# Altium project Arduino portenta H7 carrier board.PrjPcb
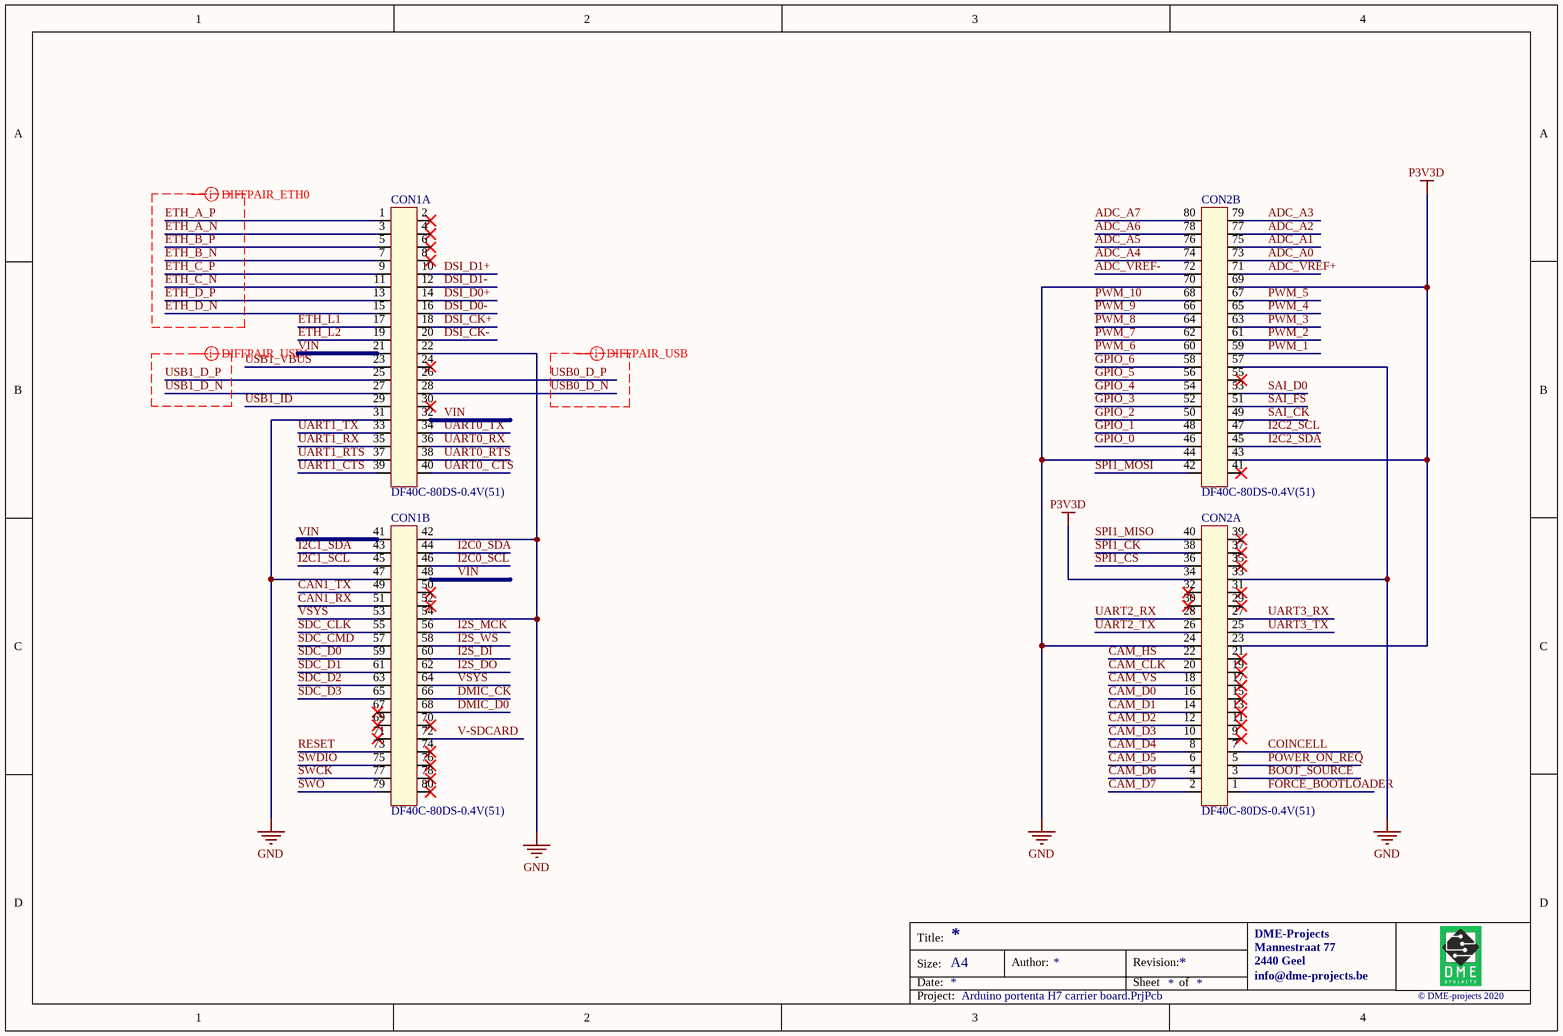
[diagram p0: Potenta connections.SchDoc]
CAGE_CODE: ?????; CONTRACT_NUMBER: <CONTRACT NO>; DOC_NO_ASSY_DWG: <ASSY DWG NO>; DOC_NO_BOM: <BOM DOC NO>; DOC_NO_FAB_DWG: <FAB DWG NO>; DOC_NO_SCH_DWG: <SCH DWG NO>; PCB_2_DEC_TOL: +/-.01; PCB_3_DEC_TOL: +/-.010; PCB_ANG_TOL: +/-1/2; PCB_ASSEMBLY_NO: <PCB ASSY NO>; PCB_CHECKER: - -----; PCB_CHECKER_APP_DATE: --/--/----; PCB_DESIGNER: - -----; PCB_DESIGNER_APP_DATE: --/--/----; PCB_DWG_NO: <PCB DWG NO>; PCB_ENGINEER: - -----; PCB_ENGINEER_APP_DATE: --/--/----; PCB_PART_NUMBER: <PCB PN>; PCB_REV: A; SCH_REV: A
4 sheets, 45 parts. Net scope: global (net labels, ports and power ports of the same name join across sheets).
Board file: Portenta H7 Carrier board.PcbDoc
Sheets:
  Potenta connections.SchDoc
  PC CONNECTIONS.SchDoc
  Expantion connectors.SchDoc
  Arduino connectors.SchDoc

## Sheet Potenta connections.SchDoc
size A4; Organization: Mirion Technologies (Canberra Olen) NV; Address1: Lammerdries-Oost 25; Address2: 2250; Address3: Olen; Address4: Belgium; ENG_APP_DATE: --/--/--; DSN_APP_DATE: --/--/--; CHK_APP_DATE: --/--/--

### Parts
CON1  DF40C-80DS-0.4V(51)  [DF40C-80DS-0.4V(51)-Footprint-1]  (parts A,B of 2)
CON2  DF40C-80DS-0.4V(51)  [DF40C-80DS-0.4V(51)-Footprint-1]  (parts A,B of 2)

### Nets
GND: CON1.22 CON1.31 CON1.42 CON1.47 CON1.54 CON2.24 CON2.33 CON2.44 CON2.57 CON2.70
P3V3D: CON2.23 CON2.34 CON2.43 CON2.69
ADC_A0: CON2.73
ADC_A1: CON2.75
ADC_A2: CON2.77
ADC_A3: CON2.79
ADC_A4: CON2.74
ADC_A5: CON2.76
ADC_A6: CON2.78
ADC_A7: CON2.80
ADC_VREF+: CON2.71
ADC_VREF-: CON2.72
BOOT_SOURCE: CON2.3
CAM_CLK: CON2.20
CAM_D0: CON2.16
CAM_D1: CON2.14
CAM_D2: CON2.12
CAM_D3: CON2.10
CAM_D4: CON2.8
CAM_D5: CON2.6
CAM_D6: CON2.4
CAM_D7: CON2.2
CAM_HS: CON2.22
CAM_VS: CON2.18
CAN1_RX: CON1.51
CAN1_TX: CON1.49
COINCELL: CON2.7
DMIC_CK: CON1.66
DMIC_D0: CON1.68
DSI_CK+: CON1.18
DSI_CK-: CON1.20
DSI_D0+: CON1.14
DSI_D0-: CON1.16
DSI_D1+: CON1.10
DSI_D1-: CON1.12
ETH_A_N: CON1.3
ETH_A_P: CON1.1
ETH_B_N: CON1.7
ETH_B_P: CON1.5
ETH_C_N: CON1.11
ETH_C_P: CON1.9
ETH_D_N: CON1.15
ETH_D_P: CON1.13
ETH_L1: CON1.17
ETH_L2: CON1.19
FORCE_BOOTLOADER: CON2.1
GPIO_0: CON2.46
GPIO_1: CON2.48
GPIO_2: CON2.50
GPIO_3: CON2.52
GPIO_4: CON2.54
GPIO_5: CON2.56
GPIO_6: CON2.58
I2C0_SCL: CON1.46
I2C0_SDA: CON1.44
I2C1_SCL: CON1.45
I2C1_SDA: CON1.43
I2C2_SCL: CON2.47
I2C2_SDA: CON2.45
I2S_DI: CON1.60
I2S_DO: CON1.62
I2S_MCK: CON1.56
I2S_WS: CON1.58
POWER_ON_REQ: CON2.5
PWM_1: CON2.59
PWM_2: CON2.61
PWM_3: CON2.63
PWM_4: CON2.65
PWM_5: CON2.67
PWM_6: CON2.60
PWM_7: CON2.62
PWM_8: CON2.64
PWM_9: CON2.66
PWM_10: CON2.68
RESET: CON1.73
SAI_CK: CON2.49
SAI_D0: CON2.53
SAI_FS: CON2.51
SDC_CLK: CON1.55
SDC_CMD: CON1.57
SDC_D0: CON1.59
SDC_D1: CON1.61
SDC_D2: CON1.63
SDC_D3: CON1.65
SPI1_CK: CON2.38
SPI1_CS: CON2.36
SPI1_MISO: CON2.40
SPI1_MOSI: CON2.42
SWCK: CON1.77
SWDIO: CON1.75
SWO: CON1.79
UART0_ CTS: CON1.40
UART0_RTS: CON1.38
UART0_RX: CON1.36
UART0_TX: CON1.34
UART1_CTS: CON1.39
UART1_RTS: CON1.37
UART1_RX: CON1.35
UART1_TX: CON1.33
UART2_RX: CON2.28
UART2_TX: CON2.26
UART3_RX: CON2.27
UART3_TX: CON2.25
USB0_D_N: CON1.28
USB0_D_P: CON1.26
USB1_D_N: CON1.27
USB1_D_P: CON1.25
USB1_ID: CON1.29
USB1_VBUS: CON1.23
V-SDCARD: CON1.72
VIN: CON1.21 CON1.32 CON1.41 CON1.48
VSYS: CON1.53 CON1.64

Not connected (* = marked no-connect by the designer): CON1 2* 4* 6* 8* 24* 30* 50* 52* 67* 69* 70* 71* 74* 76* 78* 80*; CON2 9* 11* 13* 15* 17* 19* 21* 29* 30* 31* 32* 35* 37* 39* 41* 55*

### Layout directives
differential pair; differential pair class DIFFPAIR_ETH0: ETH_A_N, ETH_A_P, ETH_B_N, ETH_B_P, ETH_C_N, ETH_C_P, ETH_D_N, ETH_D_P
differential pair; differential pair class DIFFPAIR_USB: USB0_D_N, USB0_D_P, USB1_D_N, USB1_D_P

### Notes on the sheet
- Title:
- Size:
- Date:
- A4
- Author:
- Revision:
- Sheet
- of
- DME-Projects
- Mannestraat 77
- 2440 Geel
- info@dme-projects.be
- Project:
- © DME-projects 2020

### Library data of the parts
CON1 CON2 = CMP-00029-4: DF40 Series 80 Positions 0.4 mm Pitch Dual Row SMT Receptacle Connector; Number of Contacts: 80; Mated Stacking Heights: 1.5mm; Pitch: 0.4mm; Current Rating: 300mA; Voltage Rating: 30V; Number of Rows: 2; Package Quantity: 1; Contact Material: Bronze; Housing Material: Polymer; Mount: Surface Mount; Connector Type: Receptacle; REACH SVHC: Unknown; Contact Plating: Gold; Lead Free: Lead Free; Radiation Hardening: No; Packaging: Tape and Reel; Gender: Receptacle; Termination: SMD/SMT; Number of Positions: 80; PartId: 1

## Sheet PC CONNECTIONS.SchDoc
size A4
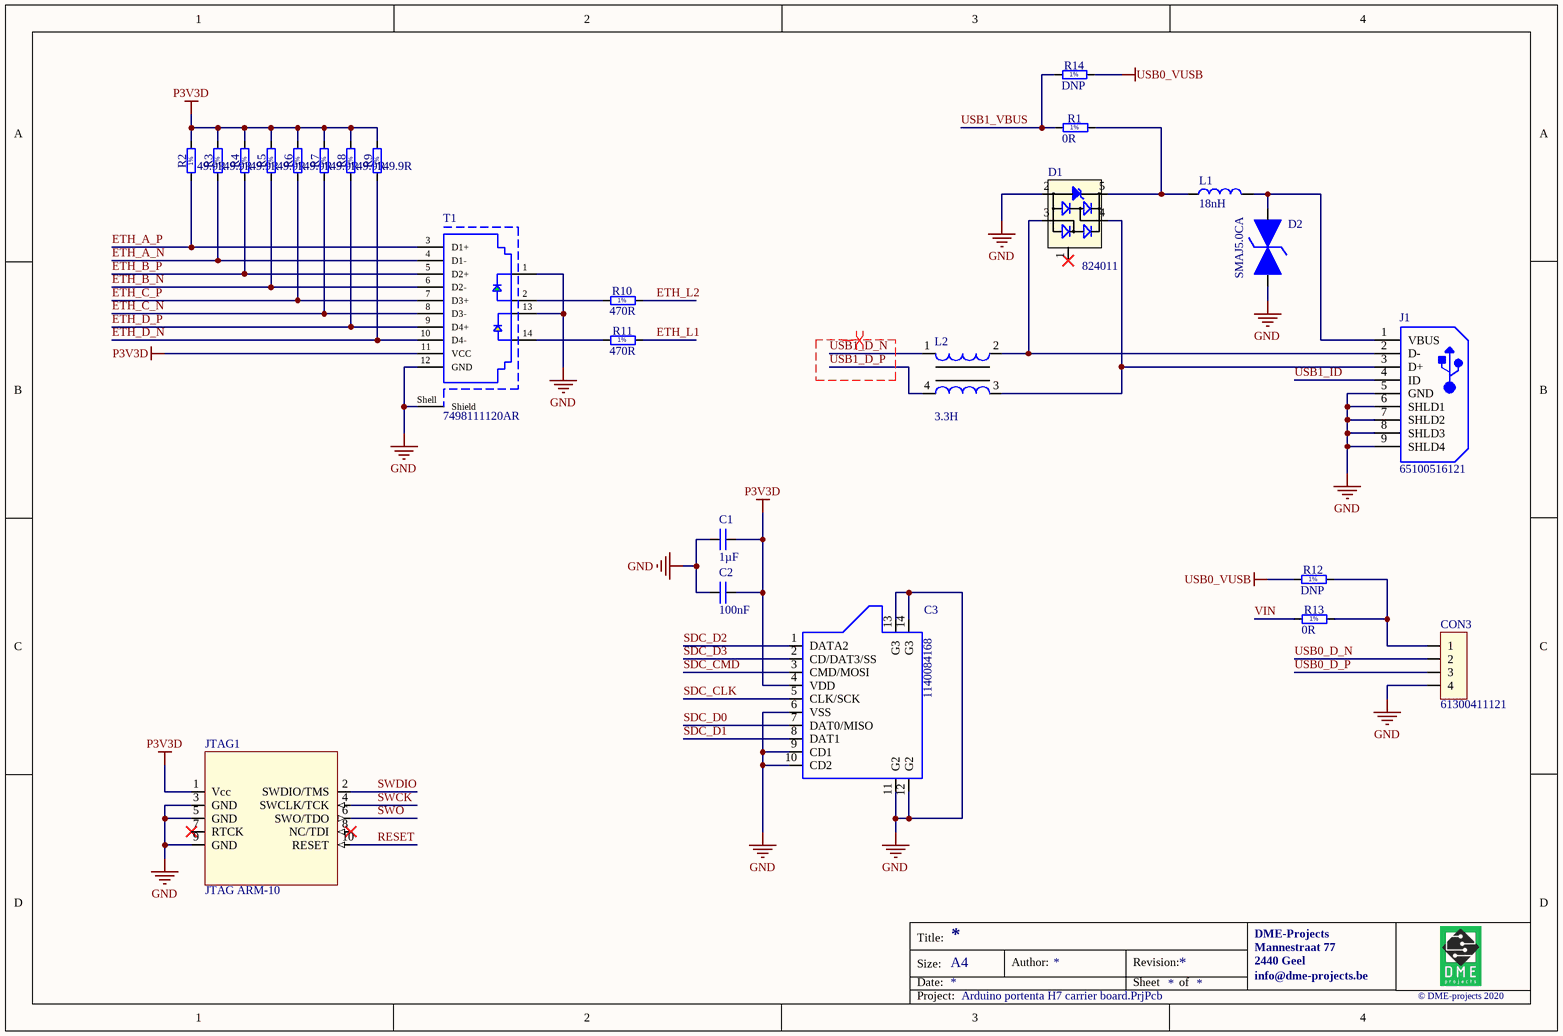
[diagram p1: PC CONNECTIONS.SchDoc]

### Parts
C1  value 1µF  [C0603]  (hidden comment: 447)
C2  value 100nF  [C0603]  (hidden comment: 423)
C3  1140084168  [Amphenol_MicroSD_Connector]
CON3  61300411121  [61300411121]
D1  824011  [ATML-5TS1_N]
D2  SMAJ5.0CA  [FP-SMAJ-MFG]
J1  65100516121  [WE-65100516121_V]
JTAG1  JTAG ARM-10  [62501021621]
L1  Inductance: 18nH  [SMD-0603]  (hidden comment: 742792641)
L2  Inductance: 3.3H  [WE-CNSW-1206]  (hidden comment: 744232090)
R1  value 0R  [R0603]  (hidden comment: 1040)
R2  value 49.9R  [R0603]  (hidden comment: 1020)
R3  value 49.9R  [R0603]  (hidden comment: 1020)
R4  value 49.9R  [R0603]  (hidden comment: 1020)
R5  value 49.9R  [R0603]  (hidden comment: 1020)
R6  value 49.9R  [R0603]  (hidden comment: 1020)
R7  value 49.9R  [R0603]  (hidden comment: 1020)
R8  value 49.9R  [R0603]  (hidden comment: 1020)
R9  value 49.9R  [R0603]  (hidden comment: 1020)
R10  value 470R  [R0603]  (hidden comment: 427)
R11  value 470R  [R0603]  (hidden comment: 427)
R12  value DNP  [R0603]  (hidden comment: 1041)
R13  value 0R  [R0603]  (hidden comment: 1040)
R14  value DNP  [R0603]  (hidden comment: 1041)
T1  7498111120AR  [7498111120AR]

### Nets
GND: C1.2 C2.1 C3.6(VSS) C3.9(CD1) C3.10(CD2) C3.11(G2) C3.12(G2) C3.13(G3) C3.14(G3) CON3.4 D1.2(GND) D2.1 J1.5(GND) J1.6(SHLD1) J1.7(SHLD2) J1.8(SHLD3) J1.9(SHLD4) JTAG1.3(GND) JTAG1.5(GND) JTAG1.9(GND) T1.1 T1.12(GND) T1.13 T1.Shell(Shield)
P3V3D: C1.1 C2.2 C3.4(VDD) JTAG1.1(Vcc) R2.2 R3.2 R4.2 R5.2 R6.2 R7.2 R8.2 R9.2 T1.11(VCC)
USB0_VUSB: R12.1 R14.2
ETH_A_N: R3.1 T1.4(D1-)
ETH_A_P: R2.1 T1.3(D1+)
ETH_B_N: R5.1 T1.6(D2-)
ETH_B_P: R4.1 T1.5(D2+)
ETH_C_N: R7.1 T1.8(D3-)
ETH_C_P: R6.1 T1.7(D3+)
ETH_D_N: R9.1 T1.10(D4-)
ETH_D_P: R8.1 T1.9(D4+)
ETH_L1: R11.2
ETH_L2: R10.2
RESET: JTAG1.10(RESET)
SDC_CLK: C3.5(CLK/SCK)
SDC_CMD: C3.3(CMD/MOSI)
SDC_D0: C3.7(DAT0/MISO)
SDC_D1: C3.8(DAT1)
SDC_D2: C3.1(DATA2)
SDC_D3: C3.2(CD/DAT3/SS)
SWCK: JTAG1.4(SWCLK/TCK)
SWDIO: JTAG1.2(SWDIO/TMS)
SWO: JTAG1.6(SWO/TDO)
USB0_D_N: CON3.2
USB0_D_P: CON3.3
USB1_D_N: L2.1
USB1_D_P: L2.4
USB1_ID: J1.4(ID)
USB1_VBUS: R1.1 R14.1
VIN: R13.1
NetCON3_1: CON3.1 R12.2 R13.2
NetD1_3: D1.3(I/O1) J1.2(D-) L2.2
NetD1_4: D1.4(I/O2) J1.3(D+) L2.3
NetD1_5: D1.5(VDD) L1.1 R1.2
NetD2_2: D2.2 J1.1(VBUS) L1.2
NetR10_1: R10.1 T1.2
NetR11_1: R11.1 T1.14

Not connected (* = marked no-connect by the designer): D1 1(NC)*; JTAG1 7(RTCK)* 8(NC/TDI)*

### Layout directives
differential pair: USB1_D_N, USB1_D_P

### Notes on the sheet
- Title:
- Size:
- Date:
- A4
- Author:
- Revision:
- Sheet
- of
- DME-Projects
- Mannestraat 77
- 2440 Geel
- info@dme-projects.be
- Project:
- © DME-projects 2020
- (in symbol CMP-209-0426-1) 1%
- (in symbol CMP-209-1019-1) 1%
- (in symbol CMP-209-1037-1) 1%
- (in symbol CMP-209-1038-1) 1%

### Library data of the parts
C1 = CMP-208-0446-2: generic 0603 capacitor; Type: Ceramic; Tolerance: 0.05; Voltage: 25V; MFG no: generic; MFG: generic
C2 = CMP-208-0422-4: generic 0603 capacitor; Tolerance: 0.05; Voltage: 50V; Type: Ceramic; MFG no: generic; MFG: generic
C3 = CMP-00036-2: Micro SD; Conn; IC Socket; ; Right Angle; PCB Mount; MicroSD Ser.; Gender: Receptacle; Pitch: 1.1mm; Number of Contacts: 8; Connector Type: Connector; Housing Material: Polymer; Package Quantity: 7500; Length: 15.6mm; Lead Free: Lead Free; Packaging: Tape and Reel; Termination: SMD/SMT; Mount: Surface Mount; Depth: 11.45mm; Contact Material: Copper Alloy,Copper; Radiation Hardening: No; Number of Rows: 1; Height: 1.55mm; Orientation: Right Angle; Contact Plating: Gold; Flammability Rating: UL94 V-0; REACH SVHC: Unknown
CON3 = CMP-00034-1: CONN HEADER VERT 4POS 2.54MM; Gender: Male; Number of Contacts: 4; Connector Type: Male Pin; Pitch: 0.1inch; Lead Free: Lead Free; Contact Material: Copper; Contact Mating Length: 0.236inch; Number of Rows: 1; REACH SVHC: Unknown; Number of Positions: 4; Packaging: Bulk; Mount: Through Hole; Contact Plating: Gold; Termination: Solder; Color: Black
D1 = CMP-004-00034-3: Trans Voltage Suppressor Diode, 5V V(RWM), Unidirectional, 1 Element, Silicon; Clamping Voltage: 8.5V; Test Current: 1mA; Max Surge Current: 12A; Power Line Protection: Yes; Max Reverse Leakage Current: 5A; Polarity: Bidirectional; Capacitance: 2pF; Number of Channels: 2; Min Breakdown Voltage: 6.1V; Operating Supply Voltage: 6V; Reverse Standoff Voltage: 5V; Packaging: Tape and Reel; Max Operating Temperature: 125°C; Working Voltage: 5V; Number of Pins: 5; Termination: SMD/SMT; Peak Pulse Current: 12A; Height: 1.16mm; Direction: Unidirectional; Mount: Surface Mount; Number of Bidirectional Channels: 2; ESD Protection: Yes; Breakdown Voltage: 6.1V; Max Breakdown Voltage: 6.1V; Length: 2.9mm; Case/Package: SOT-23; Package Quantity: 3000; REACH SVHC: Unknown; Min Operating Temperature: -55°C; Width: 2.8mm
D2 = CMP-00032-1: BOURNS - SMAJ5.0CA - TVS Diode, TRANSZORB SMAJ Series, Bidirectional, 5 V, 9.2 V, DO-214AC (SMA), 2 Pins; ESD Protection: Yes; Reverse Breakdown Voltage: 6.4V; Max Breakdown Voltage: 7V; Reverse Standoff Voltage: 5V; Number of Elements: 1; Diode Type: ZENER; Test Current: 10mA; Leakage Current: 1.6mA; Max Surge Current: 40A; Element Configuration: Single; Peak Pulse Power: 400W; Peak Pulse Current: 43.5A; Power Line Protection: No; Clamping Voltage: 9.2V; Case/Package: DO-214AC; Termination: SMD/SMT; Radiation Hardening: No; Polarity: Bidirectional; Direction: Bidirectional; Number of Channels: 1; Packaging: Tape and Reel; Min Operating Temperature: -55°C; Max Operating Temperature: 150°C; Max Reverse Leakage Current: 1.6mA; Breakdown Voltage: 7V; REACH SVHC: No SVHC; Series: SMAJ; Contact Plating: Tin; Number of Bidirectional Channels: 1; Resistor Type: Zener; Operating Supply Voltage: 5V; Package Quantity: 1; Max Power Dissipation: 400W; Number of Pins: 2; Min Breakdown Voltage: 6.4V; Mount: Surface Mount
J1 = CMP-00031-1: CONN RCPT USB2.0 MINI B SMD R/A; Number of Ports: 1; Contact Resistance: 20mR; Number of Contacts: 5; Gender: Receptacle; Working Voltage: 30V; Connector Type: USB; Mating Cycles: 1500; Insulation Resistance: 1GR; Current Rating: 1A; USB Standard: USB 2.0; Length: 7.7mm; Contact Plating: Gold; Termination: Solder; Mount: Surface Mount,Horizontal; Max Operating Temperature: 105°C; Orientation: Right Angle; Color: Black; Contact Material: Copper Alloy; REACH SVHC: Unknown; Min Operating Temperature: -40°C; Number of Positions: 5; Packaging: Tape and Reel; Package Quantity: 500; Voltage Rating: 30V; Flammability Rating: UL94 V-0; Width: 9.25mm; Series: WR-COM; Lead Free: Lead Free
JTAG1 = CMP-002-00269-2: JTAG ARM 10 pin interface connector 2mm pitch
L1 = CMP-00033-1: FERRITE BEAD 300 OHM 0603 1LN; DC Resistance (DCR): 150mR; Impedance: 300R; Max Current Rating: 2A; Number of Lines: 1; Tolerance: 25%; Test Frequency: 100MHz; Case/Package: SMD/SMT; Min Operating Temperature: -55°C; Series: WE-CBF; Depth: 0.8mm; Height: 0.8mm; Core Material: Ferrite; Width: 0.8mm; Packaging: Tape and Reel; Length: 1.6mm; Case Code (Metric): 1608; Lead Free: Lead Free; Case Code (Imperial): 0603; Max DC Current: 2A; REACH SVHC: Unknown; Max Operating Temperature: 125°C; Package Quantity: 1; Current Rating: 2A; Mount: Surface Mount; Weight: 0.000141oz; Termination: SMD/SMT; Material: Ferrite
L2 = CMP-006-00021-2: Data Line Filter, 2 Function(s), 50V, 0.37A; Test Frequency: 100MHz; Resistance: 300mR; Max DC Current: 370mA; Tolerance: 25%; Number of Lines: 2; Impedance: 90R; Core Material: Ferrite; Length: 3.2mm; Weight: 0.001376oz; DC Resistance (DCR): 300mR; Current Rating: 370mA; Mount: Surface Mount; Frequency: 100MHz; Height: 0.083inch; Min Operating Temperature: -40°C; Max Current Rating: 370mA; Max Operating Temperature: 125°C; Current: 370mA; Voltage Rating (DC): 50V; REACH SVHC: No SVHC; Termination: SMD/SMT; Depth: 1.6mm; Voltage Rating: 50V; Width: 1.6mm; Packaging: Tape and Reel; Lead Free: Lead Free; Case/Package: 1206; Package Quantity: 1
R1 R13 = CMP-209-1037-1: generic 0603 Thick film resistor; Power: 100mW; Tolerance: 0.01; Voltage: 75V; Type: Thick film; MFG: generic; MFG no: generic
R2-R9 = CMP-209-1019-1: generic 0603 Thick film resistor; Voltage: 75V; Tolerance: 0.01; Power: 100mW; MFG: generic; Type: Thick film; MFG no: generic
R10 R11 = CMP-209-0426-1: generic 0603 Thick film resistor; Power: 100mW; Tolerance: 0.01; Voltage: 75V; Type: Thick film; MFG no: generic; MFG: generic
R12 R14 = CMP-209-1038-1: generic 0603 Thick film resistor; Voltage: 75V; Power: 100mW; MFG no: generic; Type: Thick film; MFG: generic
T1 = CMP-217-0000-1: WE-RJ45 LAN Transformer, SMT, 10/100/1000 Base-T, Port 1x1, Tab Up; Manufacturer: Wurth Elektronik; USB: No; PoE: non-PoE; LED: yellow-green; Shield Tabs: Yes; ComponentLink2Description: Datasheet; Source: WE-RJ45 LAN.SchLib; Packaging: Tape and Reel; ComponentLink1URL: http://www.we-online.de; HPLE: No; Design Item ID: 7498111120AR; Data Rate: 10/100/1000 Base-T; Port Number: 1x1; ComponentLink1Description: Manufacturer; Operating Temperature: 0 to +70degC; Published Date: October 2020; Mounting Technology: SMT; ComponentLink2URL: https://www.we-online.com/catalog/datasheet/7498111120AR.pdf; Manufacturer Part Number: 7498111120AR; Tab: Up

## Sheet Expantion connectors.SchDoc
size A4
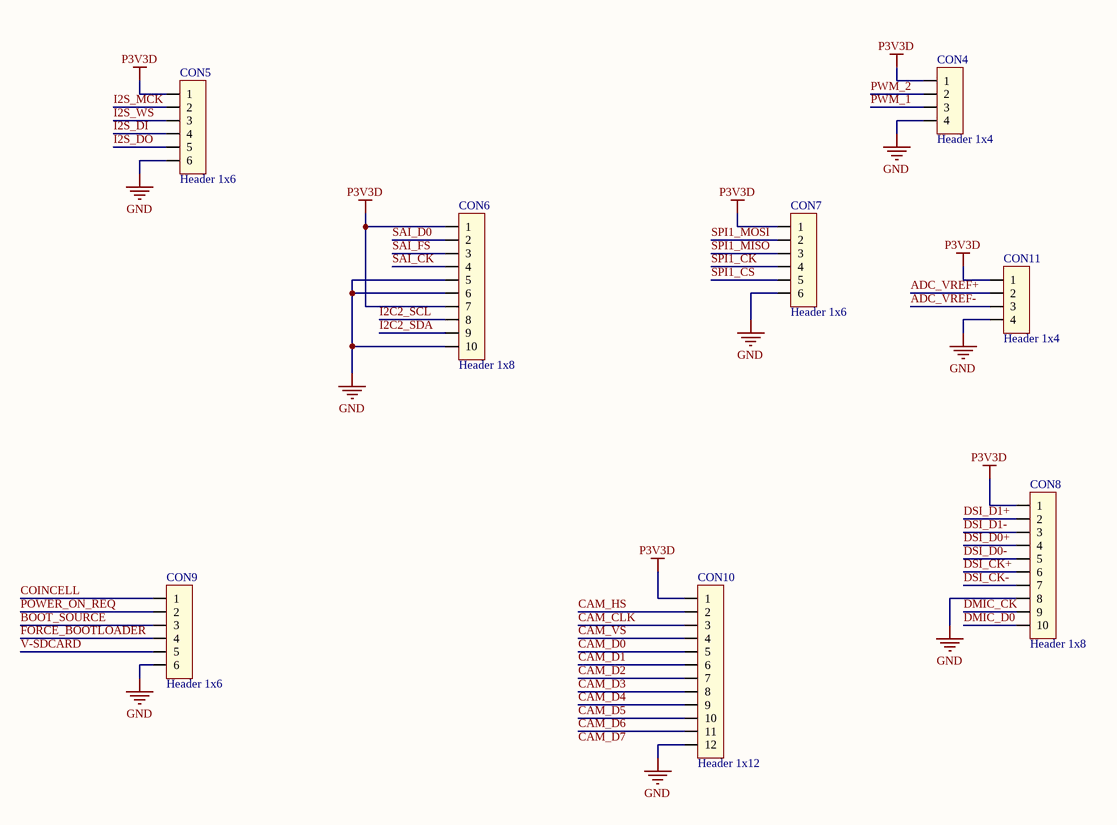
[diagram p2: Expantion connectors.SchDoc]

### Parts
CON4  Header 1x4  [61300411121]
CON5  Header 1x6  [61300611121]
CON6  Header 1x8  [61301011121]
CON7  Header 1x6  [61300611121]
CON8  Header 1x8  [61301011121]
CON9  Header 1x6  [61300611121]
CON10  Header 1x12  [61301211121]
CON11  Header 1x4  [61300411121]

### Nets
GND: CON4.4 CON5.6 CON6.5 CON6.6 CON6.10 CON7.6 CON8.8 CON9.6 CON10.12 CON11.4
P3V3D: CON4.1 CON5.1 CON6.1 CON6.7 CON7.1 CON8.1 CON10.1 CON11.1
ADC_VREF+: CON11.2
ADC_VREF-: CON11.3
BOOT_SOURCE: CON9.3
CAM_CLK: CON10.3
CAM_D0: CON10.5
CAM_D1: CON10.6
CAM_D2: CON10.7
CAM_D3: CON10.8
CAM_D4: CON10.9
CAM_D5: CON10.10
CAM_D6: CON10.11
CAM_HS: CON10.2
CAM_VS: CON10.4
COINCELL: CON9.1
DMIC_CK: CON8.9
DMIC_D0: CON8.10
DSI_CK+: CON8.6
DSI_CK-: CON8.7
DSI_D0+: CON8.4
DSI_D0-: CON8.5
DSI_D1+: CON8.2
DSI_D1-: CON8.3
FORCE_BOOTLOADER: CON9.4
I2C2_SCL: CON6.8
I2C2_SDA: CON6.9
I2S_DI: CON5.4
I2S_DO: CON5.5
I2S_MCK: CON5.2
I2S_WS: CON5.3
POWER_ON_REQ: CON9.2
PWM_1: CON4.3
PWM_2: CON4.2
SAI_CK: CON6.4
SAI_D0: CON6.2
SAI_FS: CON6.3
SPI1_CK: CON7.4
SPI1_CS: CON7.5
SPI1_MISO: CON7.3
SPI1_MOSI: CON7.2
V-SDCARD: CON9.5

### Notes on the sheet
- Labels drawn without touching a wire or pin: CAM_D7
- Title:
- Size:
- Date:
- A4
- Author:
- Revision:
- Sheet
- of
- DME-Projects
- Mannestraat 77
- 2440 Geel
- info@dme-projects.be
- Project:
- © DME-projects 2020

### Library data of the parts
CON4 CON11 = CMP-00034-2: Wurth elektronik 61300411121; Connector Type: Male Pin; Number of Positions: 4; Gender: Male; Pitch: 0.1inch; Termination: Solder; Packaging: Bulk; Lead Free: Lead Free; REACH SVHC: Unknown; Color: Black; Mount: Through Hole; Contact Plating: Gold; Contact Material: Copper; Number of Contacts: 4; Contact Mating Length: 0.236inch; Number of Rows: 1
CON5 CON7 CON9 = CMP-002-00282-1: WURTH ELEKTRONIK - 61300611121 - Pin Header, Board-to-Board, 2.54 mm, 1 Rows, 6 Contacts, Through Hole, WR-PHD Series; Voltage Rating: 250V; Current Rating: 3A; Number of Positions: 6; Pitch: 0.1inch; Connector Type: Male Pin; Gender: Male; Contact Mating Length: 0.236inch; Packaging: Bulk; Number of Rows: 1; Max Operating Temperature: 125°C; Termination: Through Hole; Mount: Through Hole; Contact Plating: Gold; Color: Black; Housing Material: PBT; Contact Gender: Male; Lead Free: Lead Free; Contact Material: Copper Alloy,Copper; Min Operating Temperature: -40°C; REACH SVHC: Unknown; Number of Contacts: 6
CON6 CON8 = CMP-00035-3: WURTH ELEKTRONIK - 61301011121 - Pin Header, Board-to-Board, 2.54 mm, 1 Rows, 10 Contacts, Through Hole, WR-PHD Series; Number of Positions: 10; Gender: Male; Connector Type: Male Pin; Voltage Rating: 250V; Pitch: 2.54mm; Insulation Resistance: 1GR; Current Rating: 3A; Packaging: Bulk; Contact Plating: Gold; Contact Gender: Male; Number of Rows: 1; Package Quantity: 1000; Flammability Rating: UL94 V-0; Contact Mating Length: 0.236inch; Contact Type: Male Pin; Housing Material: PBT; Contact Material: Copper Alloy,Copper; Min Operating Temperature: -40°C; Height: 11.54mm; Termination: Solder; Max Operating Temperature: 125°C; Color: Black; Orientation: Straight; Length: 2.54mm; REACH SVHC: Unknown; Series: WR-PHD; Width: 25.4mm; Number of Contacts: 10; Mount: Through Hole
CON10 = CMP-002-00283-1: Header 1x12 2.54mm

## Sheet Arduino connectors.SchDoc
size A4
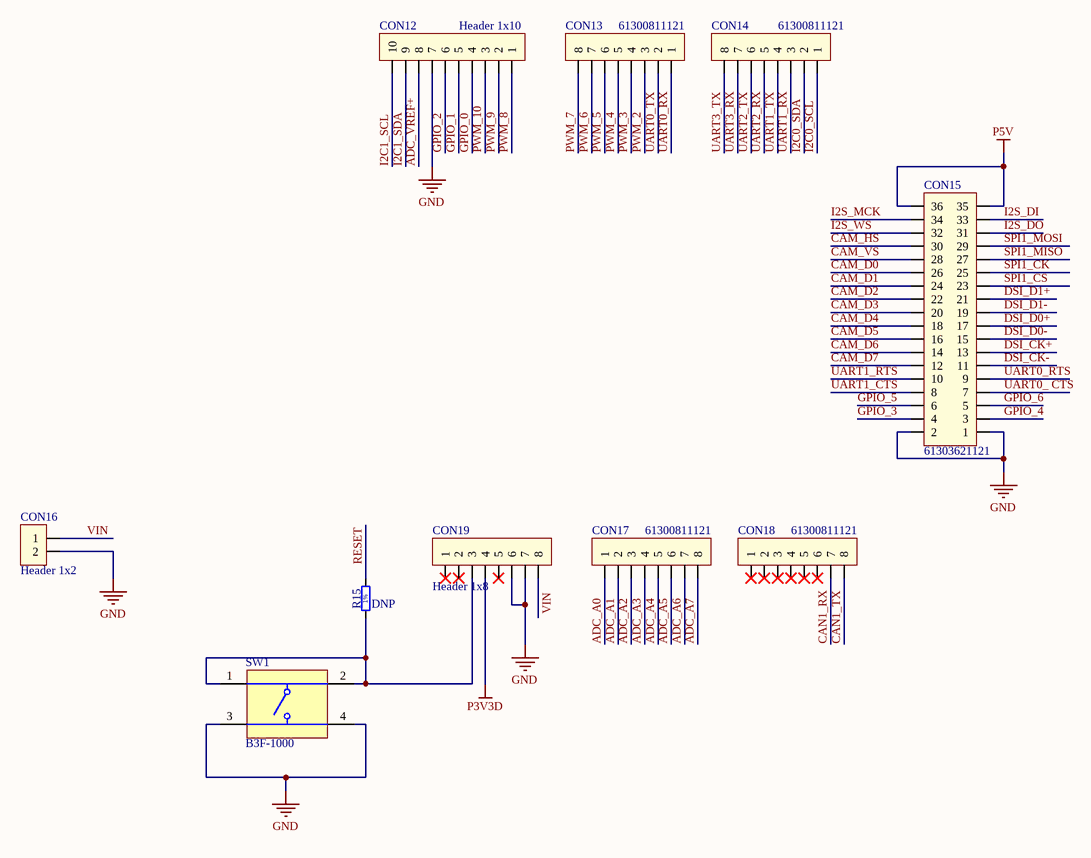
[diagram p3: Arduino connectors.SchDoc]

### Parts
CON12  Header 1x10  [61301011121]
CON13  61300811121  [61300811121]
CON14  61300811121  [61300811121]
CON15  61303621121  [61303621121]
CON16  Header 1x2  [61300211121]
CON17  61300811121  [61300811121]
CON18  61300811121  [61300811121]
CON19  Header 1x8  [61300811121]
R15  value DNP  [R0603]  (hidden comment: 1041)
SW1  B3F-1000  [OMRON-B3F-1000-4_V]

### Nets
GND: CON12.7 CON15.1 CON15.2 CON16.2 CON19.6 CON19.7 SW1.3 SW1.4
P3V3D: CON19.4
P5V: CON15.35 CON15.36
ADC_A0: CON17.1
ADC_A1: CON17.2
ADC_A2: CON17.3
ADC_A3: CON17.4
ADC_A4: CON17.5
ADC_A5: CON17.6
ADC_A6: CON17.7
ADC_A7: CON17.8
ADC_VREF+: CON12.8
CAM_D0: CON15.26
CAM_D1: CON15.24
CAM_D2: CON15.22
CAM_D3: CON15.20
CAM_D4: CON15.18
CAM_D5: CON15.16
CAM_D6: CON15.14
CAM_D7: CON15.12
CAM_HS: CON15.30
CAM_VS: CON15.28
CAN1_RX: CON18.7
CAN1_TX: CON18.8
DSI_CK+: CON15.13
DSI_CK-: CON15.11
DSI_D0+: CON15.17
DSI_D0-: CON15.15
DSI_D1+: CON15.21
DSI_D1-: CON15.19
GPIO_0: CON12.4
GPIO_1: CON12.5
GPIO_2: CON12.6
GPIO_3: CON15.4
GPIO_4: CON15.3
GPIO_5: CON15.6
GPIO_6: CON15.5
I2C0_SCL: CON14.1
I2C0_SDA: CON14.2
I2C1_SCL: CON12.10
I2C1_SDA: CON12.9
I2S_DI: CON15.33
I2S_DO: CON15.31
I2S_MCK: CON15.34
I2S_WS: CON15.32
PWM_2: CON13.3
PWM_3: CON13.4
PWM_4: CON13.5
PWM_5: CON13.6
PWM_6: CON13.7
PWM_7: CON13.8
PWM_8: CON12.1
PWM_9: CON12.2
PWM_10: CON12.3
RESET: R15.2
SPI1_CK: CON15.25
SPI1_CS: CON15.23
SPI1_MISO: CON15.27
SPI1_MOSI: CON15.29
UART0_ CTS: CON15.7
UART0_RTS: CON15.9
UART0_RX: CON13.1
UART0_TX: CON13.2
UART1_CTS: CON15.8
UART1_RTS: CON15.10
UART1_RX: CON14.3
UART1_TX: CON14.4
UART2_RX: CON14.5
UART2_TX: CON14.6
UART3_RX: CON14.7
UART3_TX: CON14.8
VIN: CON16.1 CON19.8
NetCON19_3: CON19.3 R15.1 SW1.1 SW1.2

Not connected (* = marked no-connect by the designer): CON18 1* 2* 3* 4* 5* 6*; CON19 1* 2* 5*

### Notes on the sheet
- Title:
- Size:
- Date:
- A4
- Author:
- Revision:
- Sheet
- of
- DME-Projects
- Mannestraat 77
- 2440 Geel
- info@dme-projects.be
- Project:
- © DME-projects 2020
- (in symbol CMP-209-1038-1) 1%

### Library data of the parts
CON12 = CMP-00035-4: WURTH ELEKTRONIK - 61301011121 - Pin Header, Board-to-Board, 2.54 mm, 1 Rows, 10 Contacts, Through Hole, WR-PHD Series; Gender: Male; Voltage Rating: 250V; Number of Contacts: 10; Insulation Resistance: 1GR; Connector Type: Male Pin; Pitch: 2.54mm; Current Rating: 3A; REACH SVHC: Unknown; Width: 25.4mm; Contact Type: Male Pin; Max Operating Temperature: 125°C; Contact Material: Copper Alloy,Copper; Height: 11.54mm; Color: Black; Min Operating Temperature: -40°C; Packaging: Bulk; Contact Gender: Male; Mount: Through Hole; Termination: Solder; Series: WR-PHD; Number of Positions: 10; Length: 2.54mm; Orientation: Straight; Contact Mating Length: 0.236inch; Contact Plating: Gold; Package Quantity: 1000; Number of Rows: 1; Flammability Rating: UL94 V-0; Housing Material: PBT
CON13 CON14 CON17 CON18 = CMP-002-00276-1: Board-To-Board Connector, Vertical, Wr-Phd Series, Through Hole, Header, 8, 2.54 Mm; Number of Contacts: 8; Gender: Male; Pitch: 0.1inch; Connector Type: Male Pin; Mount: Through Hole; REACH SVHC: Unknown; Packaging: Bulk; Termination: Solder; Number of Rows: 1; Contact Material: Copper; Color: Black; Contact Mating Length: 0.236inch; Number of Positions: 8; Contact Plating: Gold
CON15 = CMP-002-00281-1: WURTH ELEKTRONIK - 61303621121 - Pin Header, Vertical, Board-to-Board, 2.54 mm, 2 Rows, 36 Contacts, Through Hole Straight; Pitch: 0.1inch; Number of Contacts: 36; Gender: Male; Connector Type: Male Pin; Packaging: Bulk; Color: Black; Mount: Through Hole; Contact Mating Length: 0.236inch; Row Spacing: 0.1inch; Number of Positions: 36; Contact Material: Copper; Termination: Solder; Number of Rows: 2; Contact Plating: Gold; REACH SVHC: Unknown
CON16 = CMP-002-00284-1: Header 1x2 2.54mm
CON19 = CMP-00035-5: WURTH ELEKTRONIK - 61301011121 - Pin Header, Board-to-Board, 2.54 mm, 1 Rows, 10 Contacts, Through Hole, WR-PHD Series; Connector Type: Male Pin; Insulation Resistance: 1GR; Gender: Male; Number of Contacts: 10; Pitch: 2.54mm; Voltage Rating: 250V; Current Rating: 3A; Contact Material: Copper Alloy,Copper; Color: Black; Packaging: Bulk; Housing Material: PBT; Contact Plating: Gold; Series: WR-PHD; Termination: Solder; Contact Gender: Male; REACH SVHC: Unknown; Min Operating Temperature: -40°C; Max Operating Temperature: 125°C; Height: 11.54mm; Flammability Rating: UL94 V-0; Number of Positions: 10; Contact Type: Male Pin; Contact Mating Length: 0.236inch; Mount: Through Hole; Number of Rows: 1; Width: 25.4mm; Orientation: Straight; Length: 2.54mm; Package Quantity: 1000
R15 = CMP-209-1038-1: as R12 on sheet PC CONNECTIONS; MFG no: generic; Type: Thick film; MFG: generic
SW1 = CMP-011-00004-1: Tactile Switch, SPST-NO, 0.05 A, 24 V, -25 to 70 degC, 4-Pin THD, RoHS, Bulk; Manufacturer: Omron Electronic Components; Resistance: 0.1Ohm; Max Current Rating: 50mA; Voltage Rating: 24V; Throw Configuration: SPST; Operating Force: 100gf; Max Contact Resistance: 100mohm; RoHS Compliant: True; Package Description: 4-Pin Through Hole Device, Body 6 x 6 mm; Contact Current Rating: 50mA; Case/Package: B3F-1000; Contact Plating: Gold; Datasheet Version: Jan-15; Datasheet URL: http://www.omron.com/ecb/products/pdf/en-b3f.pdf; Package Reference: B3F-1000; Pins: 4; Package Quantity: 1500; Max Voltage Rating (DC): 24V; Mounting Technology: TH; Voltage Rating (DC): 24V; Min Operating Temperature: -25°C; Max Operating Temperature: 70°C; Current Rating: 50mA; Packaging: Bulk; Manufacturer URL: http://www.omron.com/; Contact Material: Gold

## Nets that join several sheets
GND: Potenta connections (10 pins), PC CONNECTIONS (24 pins), Expantion connectors (10 pins), Arduino connectors (8 pins)
P3V3D: Potenta connections (CON2.23 CON2.34 CON2.43 CON2.69), PC CONNECTIONS (13 pins), Expantion connectors (8 pins), Arduino connectors (CON19.4)
ADC_A0: Potenta connections (CON2.73), Arduino connectors (CON17.1)
ADC_A1: Potenta connections (CON2.75), Arduino connectors (CON17.2)
ADC_A2: Potenta connections (CON2.77), Arduino connectors (CON17.3)
ADC_A3: Potenta connections (CON2.79), Arduino connectors (CON17.4)
ADC_A4: Potenta connections (CON2.74), Arduino connectors (CON17.5)
ADC_A5: Potenta connections (CON2.76), Arduino connectors (CON17.6)
ADC_A6: Potenta connections (CON2.78), Arduino connectors (CON17.7)
ADC_A7: Potenta connections (CON2.80), Arduino connectors (CON17.8)
ADC_VREF+: Potenta connections (CON2.71), Expantion connectors (CON11.2), Arduino connectors (CON12.8)
ADC_VREF-: Potenta connections (CON2.72), Expantion connectors (CON11.3)
BOOT_SOURCE: Potenta connections (CON2.3), Expantion connectors (CON9.3)
CAM_CLK: Potenta connections (CON2.20), Expantion connectors (CON10.3)
CAM_D0: Potenta connections (CON2.16), Expantion connectors (CON10.5), Arduino connectors (CON15.26)
CAM_D1: Potenta connections (CON2.14), Expantion connectors (CON10.6), Arduino connectors (CON15.24)
CAM_D2: Potenta connections (CON2.12), Expantion connectors (CON10.7), Arduino connectors (CON15.22)
CAM_D3: Potenta connections (CON2.10), Expantion connectors (CON10.8), Arduino connectors (CON15.20)
CAM_D4: Potenta connections (CON2.8), Expantion connectors (CON10.9), Arduino connectors (CON15.18)
CAM_D5: Potenta connections (CON2.6), Expantion connectors (CON10.10), Arduino connectors (CON15.16)
CAM_D6: Potenta connections (CON2.4), Expantion connectors (CON10.11), Arduino connectors (CON15.14)
CAM_D7: Potenta connections (CON2.2), Arduino connectors (CON15.12)
CAM_HS: Potenta connections (CON2.22), Expantion connectors (CON10.2), Arduino connectors (CON15.30)
CAM_VS: Potenta connections (CON2.18), Expantion connectors (CON10.4), Arduino connectors (CON15.28)
CAN1_RX: Potenta connections (CON1.51), Arduino connectors (CON18.7)
CAN1_TX: Potenta connections (CON1.49), Arduino connectors (CON18.8)
COINCELL: Potenta connections (CON2.7), Expantion connectors (CON9.1)
DMIC_CK: Potenta connections (CON1.66), Expantion connectors (CON8.9)
DMIC_D0: Potenta connections (CON1.68), Expantion connectors (CON8.10)
DSI_CK+: Potenta connections (CON1.18), Expantion connectors (CON8.6), Arduino connectors (CON15.13)
DSI_CK-: Potenta connections (CON1.20), Expantion connectors (CON8.7), Arduino connectors (CON15.11)
DSI_D0+: Potenta connections (CON1.14), Expantion connectors (CON8.4), Arduino connectors (CON15.17)
DSI_D0-: Potenta connections (CON1.16), Expantion connectors (CON8.5), Arduino connectors (CON15.15)
DSI_D1+: Potenta connections (CON1.10), Expantion connectors (CON8.2), Arduino connectors (CON15.21)
DSI_D1-: Potenta connections (CON1.12), Expantion connectors (CON8.3), Arduino connectors (CON15.19)
ETH_A_N: Potenta connections (CON1.3), PC CONNECTIONS (R3.1 T1.4)
ETH_A_P: Potenta connections (CON1.1), PC CONNECTIONS (R2.1 T1.3)
ETH_B_N: Potenta connections (CON1.7), PC CONNECTIONS (R5.1 T1.6)
ETH_B_P: Potenta connections (CON1.5), PC CONNECTIONS (R4.1 T1.5)
ETH_C_N: Potenta connections (CON1.11), PC CONNECTIONS (R7.1 T1.8)
ETH_C_P: Potenta connections (CON1.9), PC CONNECTIONS (R6.1 T1.7)
ETH_D_N: Potenta connections (CON1.15), PC CONNECTIONS (R9.1 T1.10)
ETH_D_P: Potenta connections (CON1.13), PC CONNECTIONS (R8.1 T1.9)
ETH_L1: Potenta connections (CON1.17), PC CONNECTIONS (R11.2)
ETH_L2: Potenta connections (CON1.19), PC CONNECTIONS (R10.2)
FORCE_BOOTLOADER: Potenta connections (CON2.1), Expantion connectors (CON9.4)
GPIO_0: Potenta connections (CON2.46), Arduino connectors (CON12.4)
GPIO_1: Potenta connections (CON2.48), Arduino connectors (CON12.5)
GPIO_2: Potenta connections (CON2.50), Arduino connectors (CON12.6)
GPIO_3: Potenta connections (CON2.52), Arduino connectors (CON15.4)
GPIO_4: Potenta connections (CON2.54), Arduino connectors (CON15.3)
GPIO_5: Potenta connections (CON2.56), Arduino connectors (CON15.6)
GPIO_6: Potenta connections (CON2.58), Arduino connectors (CON15.5)
I2C0_SCL: Potenta connections (CON1.46), Arduino connectors (CON14.1)
I2C0_SDA: Potenta connections (CON1.44), Arduino connectors (CON14.2)
I2C1_SCL: Potenta connections (CON1.45), Arduino connectors (CON12.10)
I2C1_SDA: Potenta connections (CON1.43), Arduino connectors (CON12.9)
I2C2_SCL: Potenta connections (CON2.47), Expantion connectors (CON6.8)
I2C2_SDA: Potenta connections (CON2.45), Expantion connectors (CON6.9)
I2S_DI: Potenta connections (CON1.60), Expantion connectors (CON5.4), Arduino connectors (CON15.33)
I2S_DO: Potenta connections (CON1.62), Expantion connectors (CON5.5), Arduino connectors (CON15.31)
I2S_MCK: Potenta connections (CON1.56), Expantion connectors (CON5.2), Arduino connectors (CON15.34)
I2S_WS: Potenta connections (CON1.58), Expantion connectors (CON5.3), Arduino connectors (CON15.32)
POWER_ON_REQ: Potenta connections (CON2.5), Expantion connectors (CON9.2)
PWM_1: Potenta connections (CON2.59), Expantion connectors (CON4.3)
PWM_2: Potenta connections (CON2.61), Expantion connectors (CON4.2), Arduino connectors (CON13.3)
PWM_3: Potenta connections (CON2.63), Arduino connectors (CON13.4)
PWM_4: Potenta connections (CON2.65), Arduino connectors (CON13.5)
PWM_5: Potenta connections (CON2.67), Arduino connectors (CON13.6)
PWM_6: Potenta connections (CON2.60), Arduino connectors (CON13.7)
PWM_7: Potenta connections (CON2.62), Arduino connectors (CON13.8)
PWM_8: Potenta connections (CON2.64), Arduino connectors (CON12.1)
PWM_9: Potenta connections (CON2.66), Arduino connectors (CON12.2)
PWM_10: Potenta connections (CON2.68), Arduino connectors (CON12.3)
RESET: Potenta connections (CON1.73), PC CONNECTIONS (JTAG1.10), Arduino connectors (R15.2)
SAI_CK: Potenta connections (CON2.49), Expantion connectors (CON6.4)
SAI_D0: Potenta connections (CON2.53), Expantion connectors (CON6.2)
SAI_FS: Potenta connections (CON2.51), Expantion connectors (CON6.3)
SDC_CLK: Potenta connections (CON1.55), PC CONNECTIONS (C3.5)
SDC_CMD: Potenta connections (CON1.57), PC CONNECTIONS (C3.3)
SDC_D0: Potenta connections (CON1.59), PC CONNECTIONS (C3.7)
SDC_D1: Potenta connections (CON1.61), PC CONNECTIONS (C3.8)
SDC_D2: Potenta connections (CON1.63), PC CONNECTIONS (C3.1)
SDC_D3: Potenta connections (CON1.65), PC CONNECTIONS (C3.2)
SPI1_CK: Potenta connections (CON2.38), Expantion connectors (CON7.4), Arduino connectors (CON15.25)
SPI1_CS: Potenta connections (CON2.36), Expantion connectors (CON7.5), Arduino connectors (CON15.23)
SPI1_MISO: Potenta connections (CON2.40), Expantion connectors (CON7.3), Arduino connectors (CON15.27)
SPI1_MOSI: Potenta connections (CON2.42), Expantion connectors (CON7.2), Arduino connectors (CON15.29)
SWCK: Potenta connections (CON1.77), PC CONNECTIONS (JTAG1.4)
SWDIO: Potenta connections (CON1.75), PC CONNECTIONS (JTAG1.2)
SWO: Potenta connections (CON1.79), PC CONNECTIONS (JTAG1.6)
UART0_ CTS: Potenta connections (CON1.40), Arduino connectors (CON15.7)
UART0_RTS: Potenta connections (CON1.38), Arduino connectors (CON15.9)
UART0_RX: Potenta connections (CON1.36), Arduino connectors (CON13.1)
UART0_TX: Potenta connections (CON1.34), Arduino connectors (CON13.2)
UART1_CTS: Potenta connections (CON1.39), Arduino connectors (CON15.8)
UART1_RTS: Potenta connections (CON1.37), Arduino connectors (CON15.10)
UART1_RX: Potenta connections (CON1.35), Arduino connectors (CON14.3)
UART1_TX: Potenta connections (CON1.33), Arduino connectors (CON14.4)
UART2_RX: Potenta connections (CON2.28), Arduino connectors (CON14.5)
UART2_TX: Potenta connections (CON2.26), Arduino connectors (CON14.6)
UART3_RX: Potenta connections (CON2.27), Arduino connectors (CON14.7)
UART3_TX: Potenta connections (CON2.25), Arduino connectors (CON14.8)
USB0_D_N: Potenta connections (CON1.28), PC CONNECTIONS (CON3.2)
USB0_D_P: Potenta connections (CON1.26), PC CONNECTIONS (CON3.3)
USB1_D_N: Potenta connections (CON1.27), PC CONNECTIONS (L2.1)
USB1_D_P: Potenta connections (CON1.25), PC CONNECTIONS (L2.4)
USB1_ID: Potenta connections (CON1.29), PC CONNECTIONS (J1.4)
USB1_VBUS: Potenta connections (CON1.23), PC CONNECTIONS (R1.1 R14.1)
V-SDCARD: Potenta connections (CON1.72), Expantion connectors (CON9.5)
VIN: Potenta connections (CON1.21 CON1.32 CON1.41 CON1.48), PC CONNECTIONS (R13.1), Arduino connectors (CON16.1 CON19.8)